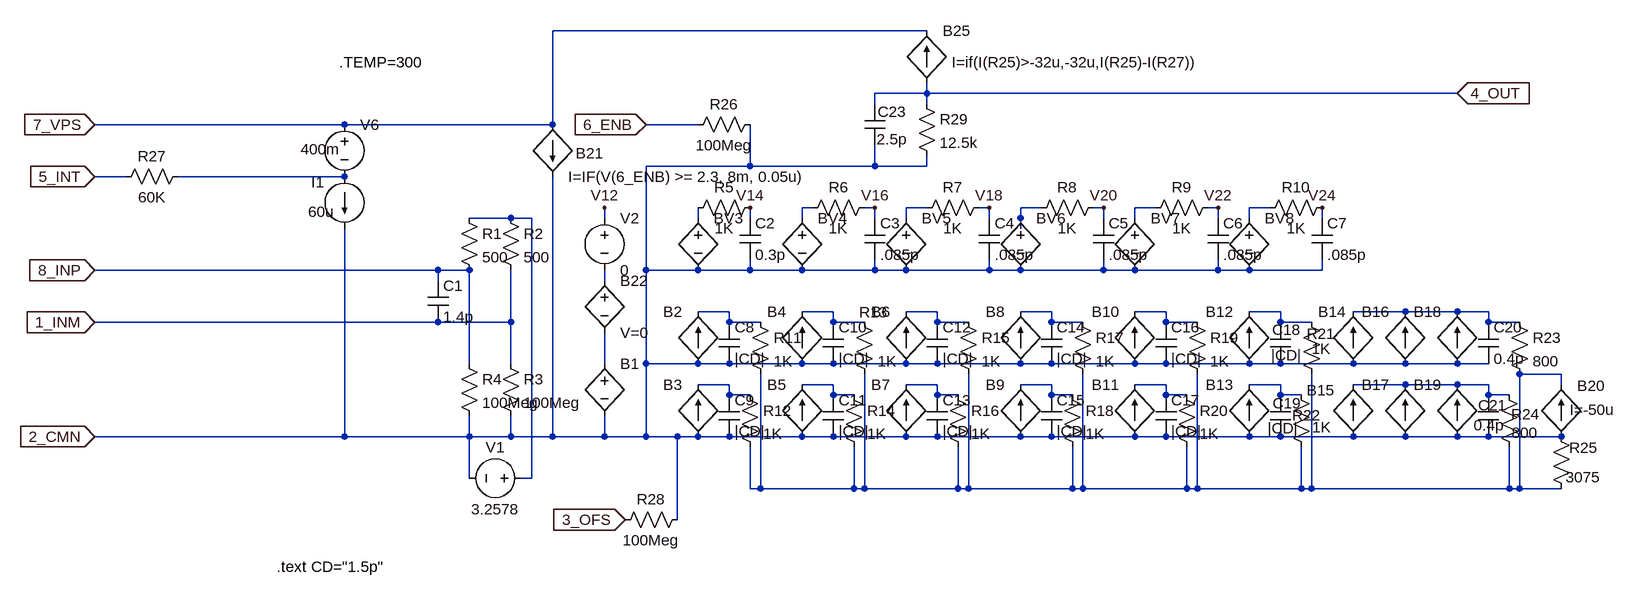
[diagram p0: schematic 8307_SUB.asc]
8307_SUB.asc, the LTspice schematic file:
Version 4
SHEET 1 2080 968
WIRE 336 -256 -240 -256
WIRE 336 -160 336 -176
WIRE 336 -160 256 -160
WIRE 1152 -160 336 -160
WIRE 256 -144 256 -160
WIRE 336 -144 336 -160
WIRE -560 -112 -944 -112
WIRE -240 -112 -240 -256
WIRE -240 -112 -560 -112
WIRE -16 -112 -96 -112
WIRE 64 -48 64 -112
WIRE 64 -48 -96 -48
WIRE 256 -48 256 -80
WIRE 256 -48 64 -48
WIRE 336 -48 336 -64
WIRE 336 -48 256 -48
WIRE -896 -32 -944 -32
WIRE -560 -32 -816 -32
WIRE 160 16 144 16
WIRE 256 16 240 16
WIRE 336 16 304 16
WIRE 432 16 416 16
WIRE 512 16 480 16
WIRE 608 16 592 16
WIRE 688 16 656 16
WIRE 784 16 768 16
WIRE 864 16 832 16
WIRE -304 32 -368 32
WIRE -272 32 -304 32
WIRE -160 32 -160 16
WIRE -16 32 -16 16
WIRE 64 32 64 16
WIRE 144 32 144 16
WIRE 256 32 256 16
WIRE 304 32 304 16
WIRE 432 32 432 16
WIRE 480 32 480 16
WIRE 608 32 608 16
WIRE 656 32 656 16
WIRE 784 32 784 16
WIRE 832 32 832 16
WIRE 944 32 944 16
WIRE 480 48 480 32
WIRE -416 112 -944 112
WIRE -368 112 -416 112
WIRE -96 112 -96 -48
WIRE -16 112 -96 112
WIRE 64 112 64 96
WIRE 64 112 -16 112
WIRE 144 112 64 112
WIRE 256 112 256 96
WIRE 256 112 144 112
WIRE 304 112 256 112
WIRE 432 112 432 96
WIRE 432 112 304 112
WIRE 480 112 432 112
WIRE 608 112 608 96
WIRE 608 112 480 112
WIRE 656 112 608 112
WIRE 784 112 784 96
WIRE 784 112 656 112
WIRE 832 112 784 112
WIRE 944 112 944 96
WIRE 944 112 832 112
WIRE -416 128 -416 112
WIRE -160 128 -160 112
WIRE 32 176 -16 176
WIRE 192 176 144 176
WIRE 352 176 304 176
WIRE 528 176 480 176
WIRE 704 176 656 176
WIRE 880 176 832 176
WIRE 1072 176 992 176
WIRE 1152 176 1072 176
WIRE 1200 176 1152 176
WIRE -416 192 -416 176
WIRE -416 192 -944 192
WIRE -304 192 -304 112
WIRE -304 192 -416 192
WIRE 32 192 32 176
WIRE 80 192 32 192
WIRE 192 192 192 176
WIRE 240 192 192 192
WIRE 352 192 352 176
WIRE 400 192 352 192
WIRE 528 192 528 176
WIRE 576 192 528 192
WIRE 704 192 704 176
WIRE 752 192 704 192
WIRE 880 192 880 176
WIRE 928 192 880 192
WIRE 1200 192 1200 176
WIRE 1248 192 1200 192
WIRE -368 256 -368 112
WIRE -304 256 -304 192
WIRE -160 256 -160 208
WIRE -96 256 -96 112
WIRE -16 256 -96 256
WIRE 32 256 -16 256
WIRE 144 256 32 256
WIRE 192 256 144 256
WIRE 304 256 192 256
WIRE 352 256 304 256
WIRE 480 256 352 256
WIRE 528 256 480 256
WIRE 656 256 528 256
WIRE 704 256 656 256
WIRE 832 256 704 256
WIRE 880 256 832 256
WIRE 992 256 880 256
WIRE 1072 256 992 256
WIRE 1152 256 1072 256
WIRE 1200 256 1152 256
WIRE 1312 272 1248 272
WIRE 32 288 -16 288
WIRE 192 288 144 288
WIRE 352 288 304 288
WIRE 528 288 480 288
WIRE 704 288 656 288
WIRE 880 288 832 288
WIRE 1072 288 992 288
WIRE 1152 288 1072 288
WIRE 1200 288 1152 288
WIRE 1312 288 1312 272
WIRE 32 304 32 288
WIRE 64 304 32 304
WIRE 192 304 192 288
WIRE 224 304 192 304
WIRE 352 304 352 288
WIRE 384 304 352 304
WIRE 528 304 528 288
WIRE 560 304 528 304
WIRE 704 304 704 288
WIRE 736 304 704 304
WIRE 880 304 880 288
WIRE 912 304 880 304
WIRE 1200 304 1200 288
WIRE 1232 304 1200 304
WIRE -560 368 -560 48
WIRE -560 368 -944 368
WIRE -368 368 -368 336
WIRE -368 368 -560 368
WIRE -304 368 -304 336
WIRE -304 368 -368 368
WIRE -240 368 -240 -32
WIRE -240 368 -304 368
WIRE -160 368 -160 336
WIRE -160 368 -240 368
WIRE -96 368 -96 256
WIRE -96 368 -160 368
WIRE -48 368 -96 368
WIRE -16 368 -48 368
WIRE 32 368 -16 368
WIRE 144 368 32 368
WIRE 192 368 144 368
WIRE 304 368 192 368
WIRE 352 368 304 368
WIRE 480 368 352 368
WIRE 528 368 480 368
WIRE 656 368 528 368
WIRE 704 368 656 368
WIRE 832 368 704 368
WIRE 880 368 832 368
WIRE 992 368 880 368
WIRE 1072 368 992 368
WIRE 1152 368 1072 368
WIRE 1200 368 1152 368
WIRE 1312 368 1200 368
WIRE -368 432 -368 368
WIRE -272 432 -272 32
WIRE -272 432 -288 432
WIRE 64 448 64 384
WIRE 80 448 80 272
WIRE 80 448 64 448
WIRE 224 448 224 384
WIRE 224 448 80 448
WIRE 240 448 240 272
WIRE 240 448 224 448
WIRE 384 448 384 384
WIRE 384 448 240 448
WIRE 400 448 400 272
WIRE 400 448 384 448
WIRE 560 448 560 384
WIRE 560 448 400 448
WIRE 576 448 576 272
WIRE 576 448 560 448
WIRE 736 448 736 384
WIRE 736 448 576 448
WIRE 752 448 752 272
WIRE 752 448 736 448
WIRE 912 448 912 384
WIRE 912 448 752 448
WIRE 928 448 928 272
WIRE 928 448 912 448
WIRE 1232 448 1232 384
WIRE 1232 448 928 448
WIRE 1248 448 1248 272
WIRE 1248 448 1232 448
WIRE 1312 448 1248 448
WIRE -48 496 -48 368
FLAG -944 112 8_INP
IOPIN -944 112 In
FLAG -944 192 1_INM
IOPIN -944 192 In
FLAG -944 368 2_CMN
IOPIN -944 368 In
FLAG -944 -112 7_VPS
IOPIN -944 -112 In
FLAG -96 -112 6_ENB
IOPIN -96 -112 In
FLAG -944 -32 5_INT
IOPIN -944 -32 In
FLAG -128 496 3_OFS
IOPIN -128 496 In
FLAG 1152 -160 4_OUT
IOPIN 1152 -160 In
FLAG 64 16 V14
FLAG 256 16 V16
FLAG 432 16 V18
FLAG 608 16 V20
FLAG 784 16 V22
FLAG 944 16 V24
FLAG -160 16 V12
SYMBOL res -384 16 R0
SYMATTR InstName R1
SYMATTR Value 500
SYMBOL res -320 16 R0
SYMATTR InstName R2
SYMATTR Value 500
SYMBOL res -320 240 R0
SYMATTR InstName R3
SYMATTR Value 100Meg
SYMBOL res -384 240 R0
SYMATTR InstName R4
SYMATTR Value 100Meg
SYMBOL voltage -272 432 R90
WINDOW 0 -32 56 VBottom 2
WINDOW 3 32 56 VTop 2
WINDOW 123 0 0 Left 0
WINDOW 39 0 0 Left 0
SYMATTR InstName V1
SYMATTR Value 3.2578
SYMBOL cap -432 128 R0
SYMATTR InstName C1
SYMATTR Value 1.4p
SYMBOL bv -160 240 R0
WINDOW 3 24 96 Invisible 2
SYMATTR Value V=IF(V(6_ENB)-V(2_CMN)> 2.3,V(8_INP)-V(1_INM),0)
SYMATTR InstName B1
SYMBOL bv -160 112 R0
SYMATTR InstName B22
SYMATTR Value V=0
SYMBOL voltage -160 16 R0
WINDOW 123 0 0 Left 0
WINDOW 39 0 0 Left 0
SYMATTR InstName V2
SYMATTR Value 0
SYMBOL bv -16 16 R0
WINDOW 3 24 96 Invisible 2
SYMATTR Value V=998.692u*(TEMP+287.775)*TANH((V(V12,2_CMN)-V(2_CMN))/(172.5u*(TEMP+274.15)))
SYMATTR InstName BV3
SYMBOL res 80 0 R90
WINDOW 0 0 56 VBottom 2
WINDOW 3 32 56 VTop 2
SYMATTR InstName R5
SYMATTR Value 1K
SYMBOL cap 48 32 R0
SYMATTR InstName C2
SYMATTR Value 0.3p
SYMBOL bv 144 16 R0
WINDOW 3 24 96 Invisible 2
SYMATTR Value V=904.1875u*(TEMP+287.334488)*TANH(V(V14,2_cmn)/(172.5u*(TEMP+274.15)))
SYMATTR InstName BV4
SYMBOL bv 304 16 R0
WINDOW 3 24 96 Invisible 2
SYMATTR Value V=903.975u*(TEMP+287.7372)*TANH(V(V16,2_cmn)/(172.5u*(TEMP+274.15)))
SYMATTR InstName BV5
SYMBOL bv 480 16 R0
WINDOW 3 24 96 Invisible 2
SYMATTR Value V=801.8u*(TEMP+301.1642)*TANH(V(V18,2_cmn)/(172.5u*(TEMP+274.15)))
SYMATTR InstName BV6
SYMBOL bv 656 16 R0
WINDOW 3 24 96 Invisible 2
SYMATTR Value V=896.75u*(TEMP+301.1642)*TANH(V(V20,2_cmn)/(172.5u*(TEMP+274.15)))
SYMATTR InstName BV7
SYMBOL bv 832 16 R0
WINDOW 3 24 96 Invisible 2
SYMATTR Value V=977.5u*(TEMP+273.2804)*TANH(V(V22,2_cmn)/(172.5u*(TEMP+274.15)))
SYMATTR InstName BV8
SYMBOL res 256 0 R90
WINDOW 0 0 56 VBottom 2
WINDOW 3 32 56 VTop 2
SYMATTR InstName R6
SYMATTR Value 1K
SYMBOL res 432 0 R90
WINDOW 0 0 56 VBottom 2
WINDOW 3 32 56 VTop 2
SYMATTR InstName R7
SYMATTR Value 1K
SYMBOL res 608 0 R90
WINDOW 0 0 56 VBottom 2
WINDOW 3 32 56 VTop 2
SYMATTR InstName R8
SYMATTR Value 1K
SYMBOL res 784 0 R90
WINDOW 0 0 56 VBottom 2
WINDOW 3 32 56 VTop 2
SYMATTR InstName R9
SYMATTR Value 1K
SYMBOL res 960 0 R90
WINDOW 0 0 56 VBottom 2
WINDOW 3 32 56 VTop 2
SYMATTR InstName R10
SYMATTR Value 1K
SYMBOL cap 240 32 R0
SYMATTR InstName C3
SYMATTR Value .085p
SYMBOL cap 416 32 R0
SYMATTR InstName C4
SYMATTR Value .085p
SYMBOL cap 592 32 R0
SYMATTR InstName C5
SYMATTR Value .085p
SYMBOL cap 768 32 R0
SYMATTR InstName C6
SYMATTR Value .085p
SYMBOL cap 928 32 R0
SYMATTR InstName C7
SYMATTR Value .085p
SYMBOL bi -16 256 R180
WINDOW 0 24 80 Left 2
WINDOW 3 24 0 Invisible 2
SYMATTR InstName B2
SYMATTR Value I=(7.76n*TEMP + 29.8147u)*(COSH(V(V14,2_CMN)/(172.5u*(TEMP+274.15)))/(1+COSH(V(V14,2_CMN)/(172.5u*(TEMP+274.15)))))
SYMBOL bi -16 368 R180
WINDOW 0 24 80 Left 2
WINDOW 3 24 0 Invisible 2
SYMATTR InstName B3
SYMATTR Value I=-(7.76n*TEMP + 29.8147u)/(1+COSH(V(V14,2_CMN)/(172.5u*(TEMP+274.15))))
SYMBOL bi 144 256 R180
WINDOW 0 24 80 Left 2
WINDOW 3 24 0 Invisible 2
SYMATTR InstName B4
SYMATTR Value I=(.9885n*TEMP + 29.70868u)*(COSH(V(V16,2_CMN)/(172.5u*(TEMP+274.15)))/(1+COSH(V(V16,2_CMN)/(172.5u*(TEMP+274.15)))))
SYMBOL bi 144 368 R180
WINDOW 0 24 80 Left 2
WINDOW 3 24 0 Invisible 2
SYMATTR InstName B5
SYMATTR Value I=-(.9885n*TEMP + 29.70868u)/(1+COSH(V(V16,2_CMN)/(172.5u*(TEMP+274.15))))
SYMBOL bi 304 256 R180
WINDOW 0 24 80 Left 2
WINDOW 3 24 0 Invisible 2
SYMATTR InstName B6
SYMATTR Value I=(.9885n*TEMP + 29.70868u)*(COSH(V(V18,2_CMN)/(172.5u*(TEMP+274.15)))/(COSH(V(V18,2_CMN)/(172.5u*(TEMP+274.15)))))
SYMBOL bi 304 368 R180
WINDOW 0 24 80 Left 2
WINDOW 3 24 0 Invisible 2
SYMATTR InstName B7
SYMATTR Value I=-(.9885n*TEMP + 29.70868u)/(1+COSH(V(V18,2_CMN)/(172.5u*(TEMP+274.15))))
SYMBOL bi 480 256 R180
WINDOW 0 24 80 Left 2
WINDOW 3 24 0 Invisible 2
SYMATTR InstName B8
SYMATTR Value I=(3.954n*TEMP + 29.6286u)*(COSH(V(V20,2_CMN)/(172.5u*(TEMP+274.15)))/(COSH(V(V20,2_CMN)/(172.5u*(TEMP+274.15)))))
SYMBOL bi 480 368 R180
WINDOW 0 24 80 Left 2
WINDOW 3 24 0 Invisible 2
SYMATTR InstName B9
SYMATTR Value I=-(3.954n*TEMP + 29.6286u)/(1+COSH(V(V20)/(172.5u*(TEMP+274.15))))
SYMBOL bi 656 256 R180
WINDOW 0 24 80 Left 2
WINDOW 3 24 0 Invisible 2
SYMATTR InstName B10
SYMATTR Value I=(7.908n*TEMP + 29.5219u)*(COSH(V(V22,2_CMN)/(172.5u*(TEMP+274.15)))/(COSH(V(V22,2_CMN)/(172.5u*(TEMP+274.15)))))
SYMBOL bi 656 368 R180
WINDOW 0 24 80 Left 2
WINDOW 3 24 0 Invisible 2
SYMATTR InstName B11
SYMATTR Value I=-(7.908n*TEMP + 29.5219u)/(1+COSH(V(V22,2_CMN)/(172.5u*(TEMP+274.15))))
SYMBOL bi 832 256 R180
WINDOW 0 24 80 Left 2
WINDOW 3 24 0 Invisible 2
SYMATTR InstName B12
SYMATTR Value I=(37.46n*TEMP + 57.0747u)*(COSH(V(V24,2_CMN)/(172.5u*(TEMP+274.15)))/(COSH(V(V24,2_CMN)/(172.5u*(TEMP+274.15)))))
SYMBOL bi 832 368 R180
WINDOW 0 24 80 Left 2
WINDOW 3 24 0 Invisible 2
SYMATTR InstName B13
SYMATTR Value I=-(37.46n*TEMP + 57.0747u)/(1+COSH(V(V24,2_CMN)/(172.5u*(TEMP+274.15))))
SYMBOL bi 992 256 R180
WINDOW 0 11 80 Left 2
WINDOW 3 24 0 Invisible 2
SYMATTR InstName B14
SYMATTR Value I=(7.132n*TEMP + 27.5784u)*(COSH(1.2*V(V12,2_CMN)/(172.5u*(TEMP + 274.15)))/(COSH(1.2*V(V12,2_CMN)/(172.5u*(TEMP + 274.15)))))
SYMBOL bi 992 368 R180
WINDOW 0 29 71 Left 2
WINDOW 3 24 0 Invisible 2
SYMATTR InstName B15
SYMATTR Value I=-(7.132n*TEMP + 27.5784u)/(1+COSH(1.2*V(V12,2_CMN)/(172.5u*(TEMP + 274.15))))
SYMBOL bi 1072 256 R180
WINDOW 0 24 80 Left 2
WINDOW 3 24 0 Invisible 2
SYMATTR InstName B16
SYMATTR Value I=(4.7n*TEMP + 26.8338u)*(COSH(.25*V(V12,2_CMN)/(172.5u*(TEMP + 274.15)))/(COSH(.25*V(V12,2_CMN)/(172.5u*(TEMP + 274.15)))))
SYMBOL bi 1072 368 R180
WINDOW 0 24 80 Left 2
WINDOW 3 24 0 Invisible 2
SYMATTR InstName B17
SYMATTR Value I=-(4.7n*TEMP + 26.8338u)/(1+COSH(.25*V(V12,2_CMN)/(172.5u*(TEMP + 274.15))))
SYMBOL bi 1152 256 R180
WINDOW 0 24 80 Left 2
WINDOW 3 24 0 Invisible 2
SYMATTR InstName B18
SYMATTR Value I=(9.564n*TEMP + 31.8017u)*(COSH(.045*V(V12,2_CMN)/(172.5u*(TEMP + 274.15)))/(1+COSH(.045*V(V12,2_CMN)/(172.5u*(TEMP + 274.15)))))
SYMBOL bi 1152 368 R180
WINDOW 0 24 80 Left 2
WINDOW 3 24 0 Invisible 2
SYMATTR InstName B19
SYMATTR Value I=-(9.564n*TEMP + 31.8017u)/(1+COSH(.045*V(V12,2_CMN)/(172.5u*(TEMP + 274.15))))
SYMBOL cap 16 192 R0
SYMATTR InstName C8
SYMATTR Value |CD|
SYMBOL cap 16 304 R0
SYMATTR InstName C9
SYMATTR Value |CD|
SYMBOL cap 176 192 R0
SYMATTR InstName C10
SYMATTR Value |CD|
SYMBOL cap 176 304 R0
SYMATTR InstName C11
SYMATTR Value |CD|
SYMBOL cap 336 192 R0
SYMATTR InstName C12
SYMATTR Value |CD|
SYMBOL cap 336 304 R0
SYMATTR InstName C13
SYMATTR Value |CD|
SYMBOL cap 512 192 R0
SYMATTR InstName C14
SYMATTR Value |CD|
SYMBOL cap 512 304 R0
SYMATTR InstName C15
SYMATTR Value |CD|
SYMBOL cap 688 192 R0
SYMATTR InstName C16
SYMATTR Value |CD|
SYMBOL cap 688 304 R0
SYMATTR InstName C17
SYMATTR Value |CD|
SYMBOL cap 864 192 R0
WINDOW 0 3 12 Left 2
WINDOW 3 2 51 Left 2
SYMATTR InstName C18
SYMATTR Value |CD|
SYMBOL cap 864 304 R0
WINDOW 0 4 13 Left 2
WINDOW 3 -4 51 Left 2
SYMATTR InstName C19
SYMATTR Value |CD|
SYMBOL res 64 176 R0
SYMATTR InstName R11
SYMATTR Value 1K
SYMBOL res 48 288 R0
SYMATTR InstName R12
SYMATTR Value 1K
SYMBOL res 224 176 R0
WINDOW 0 8 1 Left 2
SYMATTR InstName R13
SYMATTR Value 1K
SYMBOL res 208 288 R0
SYMATTR InstName R14
SYMATTR Value 1K
SYMBOL res 384 176 R0
SYMATTR InstName R15
SYMATTR Value 1K
SYMBOL res 368 288 R0
SYMATTR InstName R16
SYMATTR Value 1K
SYMBOL res 560 176 R0
SYMATTR InstName R17
SYMATTR Value 1K
SYMBOL res 544 288 R0
SYMATTR InstName R18
SYMATTR Value 1K
SYMBOL res 736 176 R0
SYMATTR InstName R19
SYMATTR Value 1K
SYMBOL res 720 288 R0
SYMATTR InstName R20
SYMATTR Value 1K
SYMBOL res 912 176 R0
WINDOW 0 8 34 Left 2
WINDOW 3 16 57 Left 2
SYMATTR InstName R21
SYMATTR Value 1K
SYMBOL res 896 288 R0
WINDOW 0 2 47 Left 2
WINDOW 3 33 66 Left 2
SYMATTR InstName R22
SYMATTR Value 1K
SYMBOL cap 1184 192 R0
SYMATTR InstName C20
SYMATTR Value 0.4p
SYMBOL cap 1184 304 R0
WINDOW 0 0 16 Left 2
WINDOW 3 -7 47 Left 2
SYMATTR InstName C21
SYMATTR Value 0.4p
SYMBOL res 1232 176 R0
SYMATTR InstName R23
SYMATTR Value 800
SYMBOL res 1216 288 R0
WINDOW 0 19 46 Left 2
WINDOW 3 20 74 Left 2
SYMATTR InstName R24
SYMATTR Value 800
SYMBOL bi 1312 368 R180
WINDOW 0 -67 78 Left 2
WINDOW 3 -83 41 Left 2
SYMATTR InstName B20
SYMATTR Value I=-50u
SYMBOL res 1296 352 R0
WINDOW 0 28 33 Left 2
WINDOW 3 23 79 Left 2
SYMATTR InstName R25
SYMATTR Value 3075
SYMBOL bi -240 -112 R0
WINDOW 0 36 44 Left 2
SYMATTR InstName B21
SYMATTR Value I=IF(V(6_ENB) >= 2.3, 8m, 0.05u)
SYMBOL res 80 -128 R90
WINDOW 0 0 56 VBottom 2
WINDOW 3 32 56 VTop 2
SYMATTR InstName R26
SYMATTR Value 100Meg
SYMBOL res -800 -48 R90
WINDOW 0 0 56 VBottom 2
WINDOW 3 32 56 VTop 2
SYMATTR InstName R27
SYMATTR Value 60K
SYMBOL res -32 480 R90
WINDOW 0 0 56 VBottom 2
WINDOW 3 32 56 VTop 2
SYMATTR InstName R28
SYMATTR Value 100Meg
SYMBOL cap 272 -80 R180
WINDOW 0 -33 52 Left 2
WINDOW 3 -34 9 Left 2
SYMATTR InstName C23
SYMATTR Value 2.5p
SYMBOL bi2 336 -256 R0
WINDOW 3 38 48 Left 2
SYMATTR Value I=if(I(R25)>-32u,-32u,I(R25)-I(R27))
SYMATTR InstName B25
SYMBOL res 320 -160 R0
SYMATTR InstName R29
SYMATTR Value 12.5k
SYMBOL voltage -560 -128 R0
WINDOW 3 -67 54 Left 2
WINDOW 123 0 0 Left 0
WINDOW 39 0 0 Left 0
SYMATTR Value 400m
SYMATTR InstName V6
SYMBOL current -560 -32 R0
WINDOW 0 -51 9 Left 2
WINDOW 3 -56 54 Left 2
WINDOW 123 0 0 Left 0
WINDOW 39 0 0 Left 0
SYMATTR InstName I1
SYMATTR Value 60u
TEXT -568 -208 Left 2 !.TEMP=300
TEXT -664 568 Left 2 !.text CD="1.5p"

The netlist it stands for:
* 8307_SUB.asc
R1 N007 8_INP 500
R2 N007 1_INM 500
R3 1_INM 2_CMN 100Meg
R4 8_INP 2_CMN 100Meg
V1 N007 2_CMN 3.2578
C1 8_INP 1_INM 1.4p
B1 N017 2_CMN V=IF(V(6_ENB)-V(2_CMN)> 2.3,V(8_INP)-V(1_INM),0)
B22 N009 N017 V=0
V2 V12 N009 0
BV3 N008 2_CMN V=998.692u*(TEMP+287.775)*TANH((V(V12,2_CMN)-V(2_CMN))/(172.5u*(TEMP+274.15)))
R5 V14 N008 1K
C2 V14 2_CMN 0.3p
BV4 N002 2_CMN V=904.1875u*(TEMP+287.334488)*TANH(V(V14,2_cmn)/(172.5u*(TEMP+274.15)))
BV5 N003 2_CMN V=903.975u*(TEMP+287.7372)*TANH(V(V16,2_cmn)/(172.5u*(TEMP+274.15)))
BV6 N004 2_CMN V=801.8u*(TEMP+301.1642)*TANH(V(V18,2_cmn)/(172.5u*(TEMP+274.15)))
BV7 N005 2_CMN V=896.75u*(TEMP+301.1642)*TANH(V(V20,2_cmn)/(172.5u*(TEMP+274.15)))
BV8 N006 2_CMN V=977.5u*(TEMP+273.2804)*TANH(V(V22,2_cmn)/(172.5u*(TEMP+274.15)))
R6 V16 N002 1K
R7 V18 N003 1K
R8 V20 N004 1K
R9 V22 N005 1K
R10 V24 N006 1K
C3 V16 2_CMN .085p
C4 V18 2_CMN .085p
C5 V20 2_CMN .085p
C6 V22 2_CMN .085p
C7 V24 2_CMN .085p
B2 2_CMN N010 I=(7.76n*TEMP + 29.8147u)*(COSH(V(V14,2_CMN)/(172.5u*(TEMP+274.15)))/(1+COSH(V(V14,2_CMN)/(172.5u*(TEMP+274.15)))))
B3 2_CMN N019 I=-(7.76n*TEMP + 29.8147u)/(1+COSH(V(V14,2_CMN)/(172.5u*(TEMP+274.15))))
B4 2_CMN N011 I=(.9885n*TEMP + 29.70868u)*(COSH(V(V16,2_CMN)/(172.5u*(TEMP+274.15)))/(1+COSH(V(V16,2_CMN)/(172.5u*(TEMP+274.15)))))
B5 2_CMN N020 I=-(.9885n*TEMP + 29.70868u)/(1+COSH(V(V16,2_CMN)/(172.5u*(TEMP+274.15))))
B6 2_CMN N012 I=(.9885n*TEMP + 29.70868u)*(COSH(V(V18,2_CMN)/(172.5u*(TEMP+274.15)))/(COSH(V(V18,2_CMN)/(172.5u*(TEMP+274.15)))))
B7 2_CMN N021 I=-(.9885n*TEMP + 29.70868u)/(1+COSH(V(V18,2_CMN)/(172.5u*(TEMP+274.15))))
B8 2_CMN N013 I=(3.954n*TEMP + 29.6286u)*(COSH(V(V20,2_CMN)/(172.5u*(TEMP+274.15)))/(COSH(V(V20,2_CMN)/(172.5u*(TEMP+274.15)))))
B9 2_CMN N022 I=-(3.954n*TEMP + 29.6286u)/(1+COSH(V(V20)/(172.5u*(TEMP+274.15))))
B10 2_CMN N014 I=(7.908n*TEMP + 29.5219u)*(COSH(V(V22,2_CMN)/(172.5u*(TEMP+274.15)))/(COSH(V(V22,2_CMN)/(172.5u*(TEMP+274.15)))))
B11 2_CMN N023 I=-(7.908n*TEMP + 29.5219u)/(1+COSH(V(V22,2_CMN)/(172.5u*(TEMP+274.15))))
B12 2_CMN N015 I=(37.46n*TEMP + 57.0747u)*(COSH(V(V24,2_CMN)/(172.5u*(TEMP+274.15)))/(COSH(V(V24,2_CMN)/(172.5u*(TEMP+274.15)))))
B13 2_CMN N024 I=-(37.46n*TEMP + 57.0747u)/(1+COSH(V(V24,2_CMN)/(172.5u*(TEMP+274.15))))
B14 2_CMN N016 I=(7.132n*TEMP + 27.5784u)*(COSH(1.2*V(V12,2_CMN)/(172.5u*(TEMP + 274.15)))/(COSH(1.2*V(V12,2_CMN)/(172.5u*(TEMP + 274.15)))))
B15 2_CMN N025 I=-(7.132n*TEMP + 27.5784u)/(1+COSH(1.2*V(V12,2_CMN)/(172.5u*(TEMP + 274.15))))
B16 2_CMN N016 I=(4.7n*TEMP + 26.8338u)*(COSH(.25*V(V12,2_CMN)/(172.5u*(TEMP + 274.15)))/(COSH(.25*V(V12,2_CMN)/(172.5u*(TEMP + 274.15)))))
B17 2_CMN N025 I=-(4.7n*TEMP + 26.8338u)/(1+COSH(.25*V(V12,2_CMN)/(172.5u*(TEMP + 274.15))))
B18 2_CMN N016 I=(9.564n*TEMP + 31.8017u)*(COSH(.045*V(V12,2_CMN)/(172.5u*(TEMP + 274.15)))/(1+COSH(.045*V(V12,2_CMN)/(172.5u*(TEMP + 274.15)))))
B19 2_CMN N025 I=-(9.564n*TEMP + 31.8017u)/(1+COSH(.045*V(V12,2_CMN)/(172.5u*(TEMP + 274.15))))
C8 N010 2_CMN |CD|
C9 N019 2_CMN |CD|
C10 N011 2_CMN |CD|
C11 N020 2_CMN |CD|
C12 N012 2_CMN |CD|
C13 N021 2_CMN |CD|
C14 N013 2_CMN |CD|
C15 N022 2_CMN |CD|
C16 N014 2_CMN |CD|
C17 N023 2_CMN |CD|
C18 N015 2_CMN |CD|
C19 N024 2_CMN |CD|
R11 N010 N018 1K
R12 N019 N018 1K
R13 N011 N018 1K
R14 N020 N018 1K
R15 N012 N018 1K
R16 N021 N018 1K
R17 N013 N018 1K
R18 N022 N018 1K
R19 N014 N018 1K
R20 N023 N018 1K
R21 N015 N018 1K
R22 N024 N018 1K
C20 N016 2_CMN 0.4p
C21 N025 2_CMN 0.4p
R23 N016 N018 800
R24 N025 N018 800
B20 2_CMN N018 I=-50u
R25 2_CMN N018 3075
B21 7_VPS 2_CMN I=IF(V(6_ENB) >= 2.3, 8m, 0.05u)
R26 2_CMN 6_ENB 100Meg
R27 N001 5_INT 60K
R28 2_CMN 3_OFS 100Meg
C23 2_CMN 4_OUT 2.5p
B25 4_OUT 7_VPS I=if(I(R25)>-32u,-32u,I(R25)-I(R27))
R29 4_OUT 2_CMN 12.5k
V6 7_VPS N001 400m
I1 N001 2_CMN 60u
.TEMP=300
.text CD="1.5p"
.backanno
.end